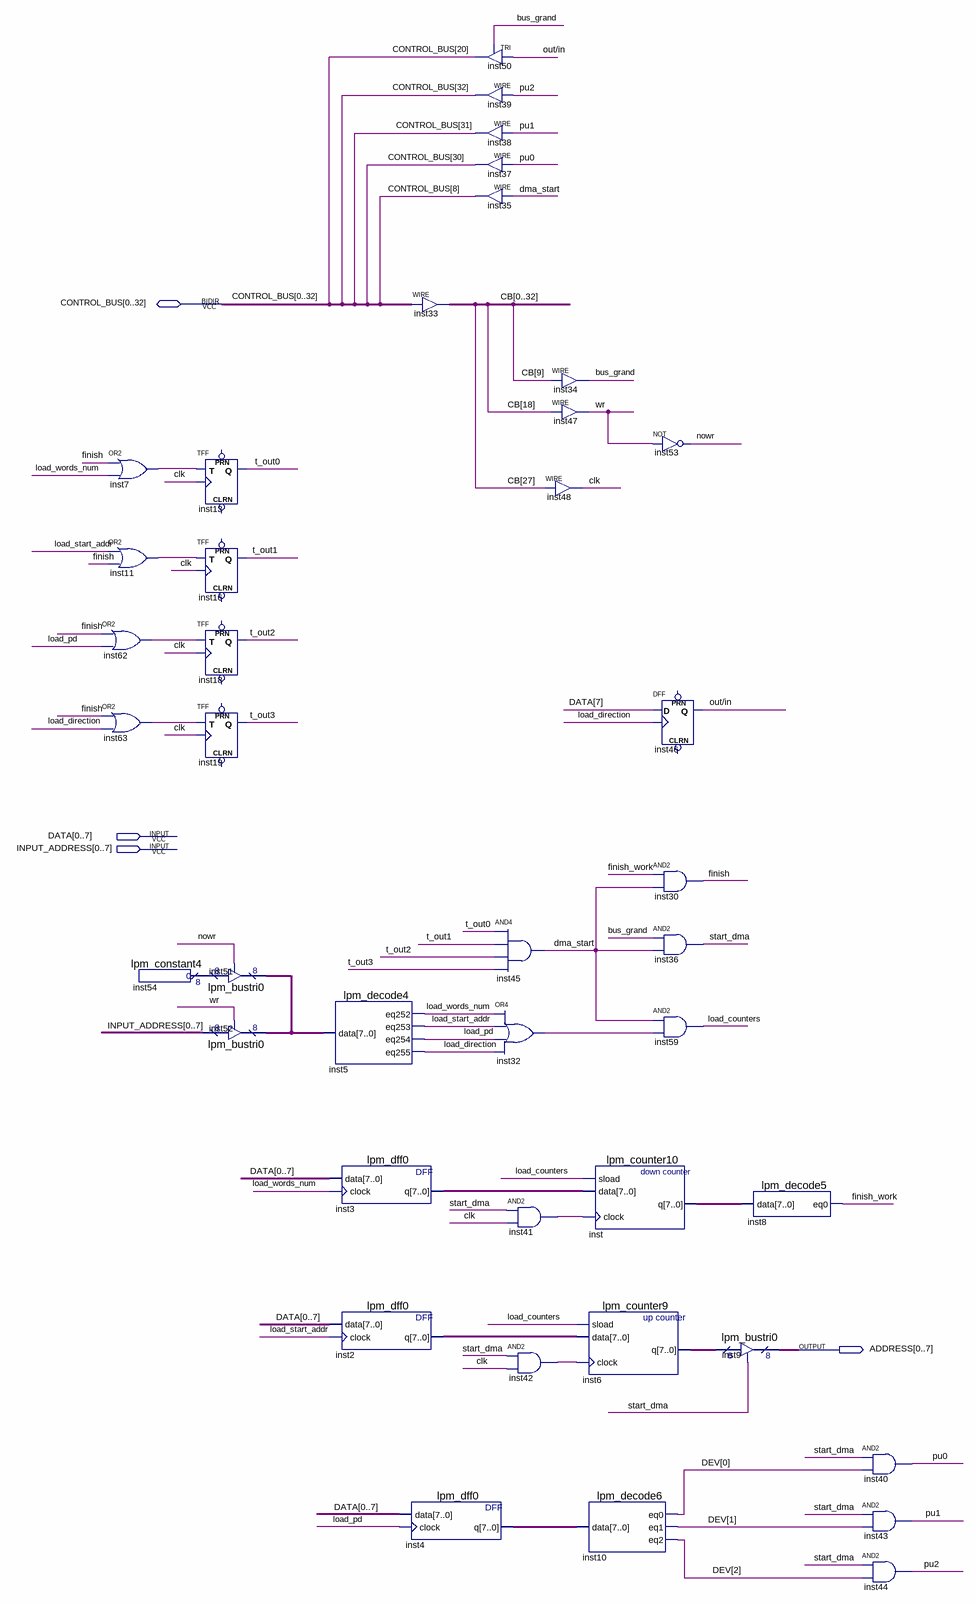
[diagram p0: schematic sheet]
// Quartus schematic DMA.bdf as structural Verilog: 41 symbols, 4 pins
module DMA (
  input  [0:7] DATA,
  input  [0:7] INPUT_ADDRESS,
  inout  [0:32] CONTROL_BUS,
  output [0:7] ADDRESS
);

  wire bus_grand, clk, dma_start, finish, finish_work, inst7_out, inst11_out, inst32_out, inst41_out,
       inst42_out, inst62_out, inst63_out, load_counters, load_direction, load_pd, load_start_addr,
       load_words_num, nowr, \out/in , pu0, pu1, pu2, start_dma, t_out0, t_out1, t_out2, t_out3, wr;
  wire [2:0] DEV;
  wire [7:0] inst2_q, inst3_q, inst4_q, inst6_q, inst51_tridata, inst54_result, inst_q;
  wire [32:0] CB;

  or inst62 (inst62_out, finish, load_pd);
  or inst63 (inst63_out, finish, load_direction);
  or inst7 (inst7_out, finish, load_words_num);
  or inst11 (inst11_out, load_start_addr, finish);
  lpm_constant4 inst54 (.result(inst54_result));
  TFF inst13 (.T(inst7_out), .CLK(clk), .Q(t_out0));  // open: PRN, CLRN
  TFF inst16 (.T(inst11_out), .CLK(clk), .Q(t_out1));  // open: PRN, CLRN
  TFF inst18 (.T(inst62_out), .CLK(clk), .Q(t_out2));  // open: PRN, CLRN
  TFF inst19 (.T(inst63_out), .CLK(clk), .Q(t_out3));  // open: PRN, CLRN
  lpm_bustri0 inst51 (.enabledt(nowr), .data(inst54_result), .tridata(inst51_tridata));
  lpm_bustri0 inst52 (.enabledt(wr), .data(INPUT_ADDRESS), .tridata(inst51_tridata));
  lpm_decode4 inst5 (
    .data(inst51_tridata), .eq252(load_words_num), .eq253(load_start_addr), .eq254(load_pd),
    .eq255(load_direction));
  lpm_dff0 inst3 (.data(DATA), .clock(load_words_num), .q(inst3_q));
  lpm_dff0 inst2 (.data(DATA), .clock(load_start_addr), .q(inst2_q));
  lpm_dff0 inst4 (.data(DATA), .clock(load_pd), .q(inst4_q));
  assign {CB[0], CB[1], CB[2], CB[3], CB[4], CB[5], CB[6], CB[7], CB[8], CB[9], CB[10], CB[11], CB[12], CB[13], CB[14], CB[15], CB[16], CB[17], CB[18], CB[19], CB[20], CB[21], CB[22], CB[23], CB[24], CB[25], CB[26], CB[27], CB[28], CB[29], CB[30], CB[31], CB[32]} = CONTROL_BUS;  // WIRE inst33
  TRI inst50 (.IN(\out/in ), .OE(bus_grand), .OUT(CONTROL_BUS[20]));
  assign CONTROL_BUS[32] = pu2;  // WIRE inst39
  assign CONTROL_BUS[31] = pu1;  // WIRE inst38
  assign CONTROL_BUS[30] = pu0;  // WIRE inst37
  assign CONTROL_BUS[8] = dma_start;  // WIRE inst35
  and inst45 (dma_start, t_out0, t_out1, t_out2, t_out3);
  or inst32 (inst32_out, load_words_num, load_start_addr, load_pd, load_direction);
  and inst41 (inst41_out, start_dma, clk);
  and inst42 (inst42_out, start_dma, clk);
  assign bus_grand = CB[9];  // WIRE inst34
  assign wr = CB[18];  // WIRE inst47
  assign clk = CB[27];  // WIRE inst48
  lpm_counter10 inst (.sload(load_counters), .data(inst3_q), .clock(inst41_out), .q(inst_q));
  lpm_counter9 inst6 (.sload(load_counters), .data(inst2_q), .clock(inst42_out), .q(inst6_q));
  lpm_decode6 inst10 (.data(inst4_q), .eq0(DEV[0]), .eq1(DEV[1]), .eq2(DEV[2]));
  not inst53 (nowr, wr);
  DFF inst46 (.CLK(load_direction), .D(DATA[7]), .Q(\out/in ));  // open: CLRN, PRN
  and inst30 (finish, finish_work, dma_start);
  and inst36 (start_dma, bus_grand, dma_start);
  and inst59 (load_counters, dma_start, inst32_out);
  lpm_decode5 inst8 (.data(inst_q), .eq0(finish_work));
  lpm_bustri0 inst9 (.enabledt(start_dma), .data(inst6_q), .tridata(ADDRESS));
  and inst40 (pu0, start_dma, DEV[0]);
  and inst43 (pu1, start_dma, DEV[1]);
  and inst44 (pu2, start_dma, DEV[2]);
endmodule
